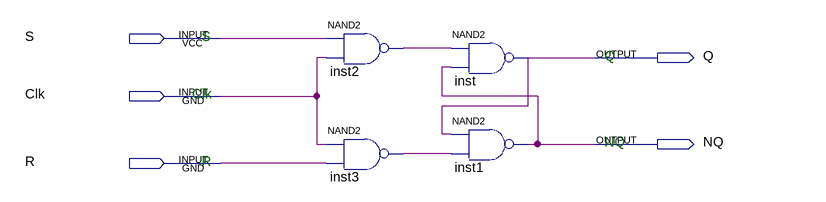
[diagram p0: schematic sheet]
// Quartus schematic Clocked_SR_FlipFlop.bdf as structural Verilog: 4 symbols, 5 pins
module Clocked_SR_FlipFlop (
  input  S,
  input  Clk,
  input  R,
  output Q,
  output NQ
);

  wire inst2_out, inst3_out;

  nand inst2 (inst2_out, S, Clk);
  nand inst3 (inst3_out, Clk, R);
  nand inst (Q, inst2_out, NQ);
  nand inst1 (NQ, Q, inst3_out);

  // Notes on the sheet:
  //   S
  //   Q
  //   Clk
  //   NQ
  //   R
endmodule
